# Altium schematic sheet PROTOCOL_PART.SchDoc
size A
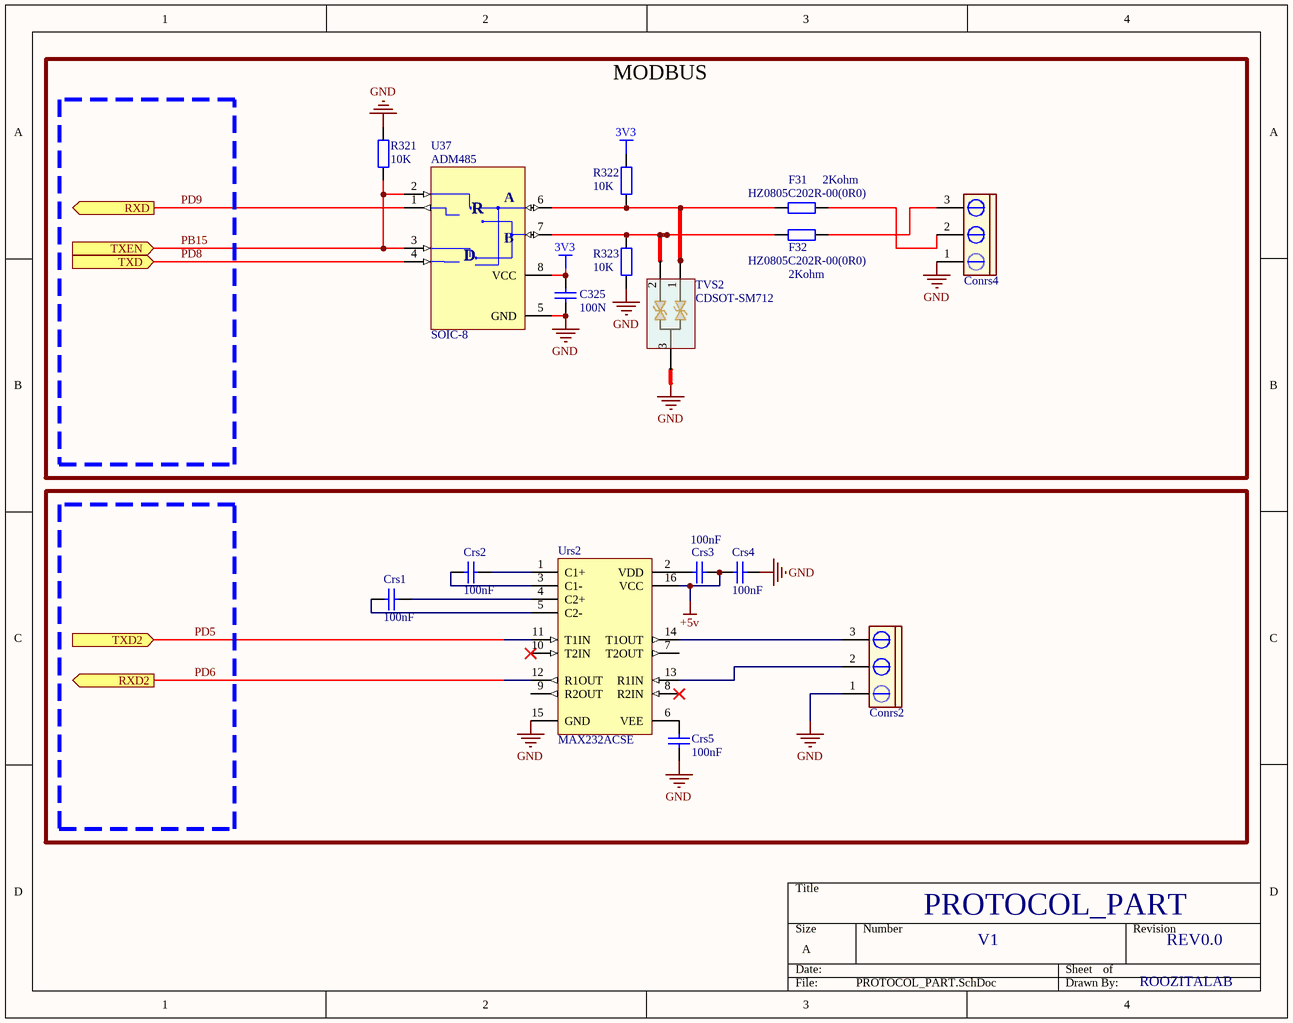
[diagram p0: PROTOCOL_PART.SchDoc]

## Parts
C325  value 100N  [0805.]
Conrs2  CON3 pin Green  [My_CN3]  (value not drawn)
Conrs4  CON3 pin Green  [My_CN3]  (value not drawn)
Crs1  value 100nF  [CAP 1206 (3216X08L)]  (hidden comment: Cap)
Crs2  value 100nF  [CAP 1206 (3216X08L)]  (hidden comment: Cap)
Crs3  value 100nF  [CAP 1206 (3216X08L)]  (hidden comment: Cap)
Crs4  value 100nF  [CAP 1206 (3216X08L)]  (hidden comment: Cap)
Crs5  value 100nF  [CAP 1206 (3216X08L)]  (hidden comment: Cap)
F31  HZ0805C202R-00(0R0)  [0805.]
F32  HZ0805C202R-00(0R0)  [0805.]
R321  value 10K  [0805.]
R322  value 10K  [0805.]
R323  value 10K  [0805.]
TVS2  CDSOT-SM712  [2N3906_SMD]
U37  ADM485  [SOIC8]
Urs2  MAX232ACSE  [SOIC16]

## Blocks framed on the sheet
MODBUS: C325 Conrs4 F31 F32 R321-R323 TVS2 U37

## Ports
RXD2 (out), RXD (out), TXD2 (in), TXD (in), TXEN (in)

## Nets
3V3: C325.2 R322.1 U37.8(VCC)
+5v: Crs3.1 Crs4.2 Urs2.16(VCC)
GND: C325.1 Conrs2.1 Conrs4.1 Crs4.1 Crs5.1 R321.1 R323.2 TVS2.3 U37.5(GND) Urs2.15(GND)
PB15: R321.2 U37.2(~{RE}) U37.3(DE) ; port TXEN
PD5: Urs2.11(T1IN) ; port TXD2
PD6: Urs2.12(R1OUT) ; port RXD2
PD8: U37.4(DI) ; port TXD
PD9: U37.1(RO) ; port RXD
NetConrs2_2: Conrs2.2 Urs2.13(R1IN)
NetConrs2_3: Conrs2.3 Urs2.14(T1OUT)
NetConrs4_2: Conrs4.2 F31.2
NetConrs4_3: Conrs4.3 F32.2
NetCrs1_1: Crs1.1 Urs2.5(C2-)
NetCrs1_2: Crs1.2 Urs2.4(C2+)
NetCrs2_1: Crs2.1 Urs2.1(C1+)
NetCrs2_2: Crs2.2 Urs2.3(C1-)
NetCrs3_2: Crs3.2 Urs2.2(VDD)
NetCrs5_2: Crs5.2 Urs2.6(VEE)
NetF31_1: F31.1 R322.2 TVS2.1 U37.6(A)
NetF32_1: F32.1 R323.1 TVS2.2 U37.7(B)

Not connected (* = marked no-connect by the designer): Urs2 7(T2OUT) 8(R2IN)* 9(R2OUT) 10(T2IN)*

## Notes on the sheet
- (near F31) 2Kohm
- (near F32) 2Kohm
- (near U37) SOIC-8
- PROTOCOL_PART
- V1
- REV0.0
- ROOZITALAB
- (in symbol MAX485EPA) R; D

## Library data of the parts
C325 = Cap: Capacitor; Manufacturer: Generic Components; Class: Passive; Published: 08/06/2000; Publisher: Altium Hobart Technology Centre; SubClass: Capacitor
Conrs2 Conrs4 = CON3 pin Green: Connector green screw
Crs1-Crs5 = Cap: Capacitor; Published: 8-Jun-2000; LatestRevisionDate: 17-Jul-2002; LatestRevisionNote: Re-released for DXP Platform.; PackageReference: RAD-0.3; Publisher: Altium Limited
F31 F32 = Res2: Resistor; Published: 8-Jun-2000; Revision: July-2002: Re-released for DXP Platform.; Publisher: Altium Limited
R321-R323 = Res2: Resistor; Manufacturer: Generic Components; Class: Passive; Published: 08/06/2000; Publisher: Altium Hobart Technology Centre; SubClass: Resistor
TVS2 = nup2105
U37 = MAX485EPA: Low-Power, Slew-Rate-Limited RS-485/RS-422 Transceiver; Manufacturer: Maxim; Class: Communication; Published: 16/01/2001; Publisher: Altium Hobart Technology Centre; SubClass: Transceiver
Urs2 = MAX232ACSE: +5V Powered, Multi-Channel RS-232 Driver/Receiver; Published: 16-Jan-2001; LatestRevisionDate: 13-Apr-2006; LatestRevisionNote: IPC-7351 Footprint Added.; PackageReference: NSO16; Publisher: Altium Limited; PackageDescription: 16-Pin Small Outline Integrated Circuit 1.27 mm Pitch; Code_JEDEC: MS-012-AC; Code_IPC: SOIC127P600-16; ComponentLink1Description: Manufacturer Link; ComponentLink1URL: http://www.maxim-ic.com/; ComponentLink2Description: Datasheet; ComponentLink2URL: http://pdfserv.maxim-ic.com/en/ds/MAX220-MAX249.pdf